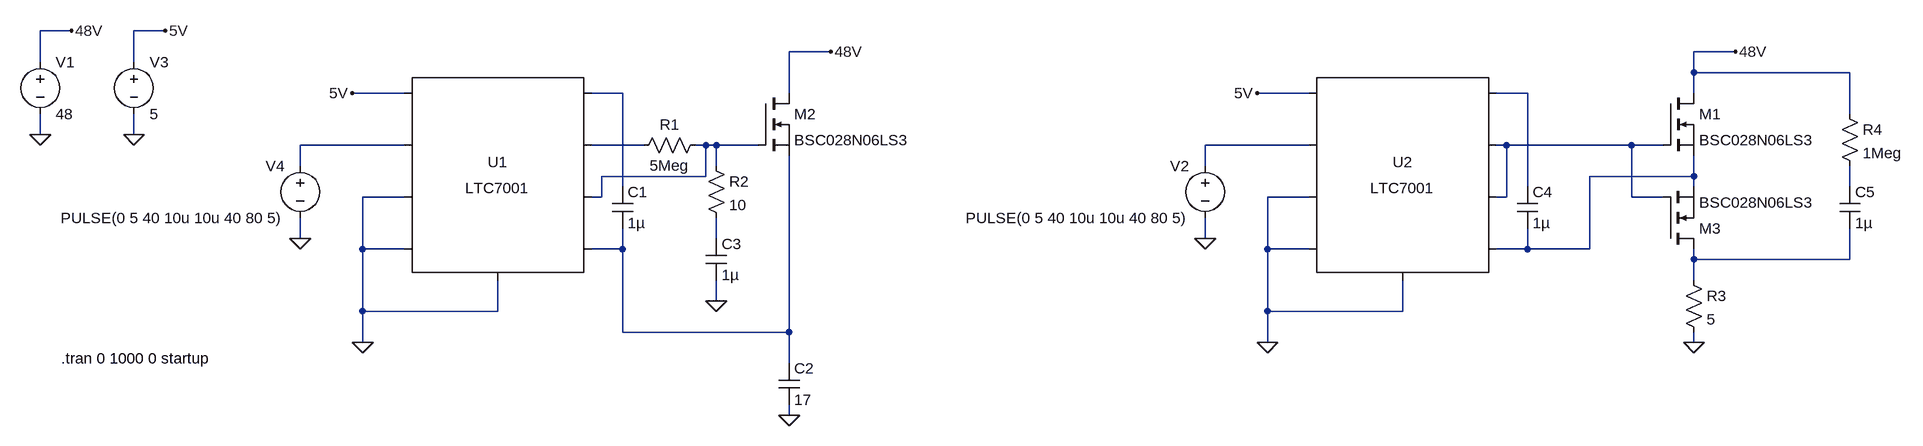
[diagram p0: schematic highside_pmos.asc]
highside_pmos.asc, the LTspice schematic file:
Version 4
SHEET 1 2584 1332
WIRE -240 544 -288 544
WIRE -96 544 -144 544
WIRE 928 576 864 576
WIRE 2320 576 2256 576
WIRE -288 592 -288 544
WIRE -144 592 -144 544
WIRE 2256 608 2256 576
WIRE 2496 608 2256 608
WIRE 272 640 192 640
WIRE 608 640 560 640
WIRE 864 640 864 576
WIRE 1664 640 1584 640
WIRE 2000 640 1952 640
WIRE 2256 640 2256 608
WIRE 2496 672 2496 608
WIRE -288 704 -288 672
WIRE -144 704 -144 672
WIRE 272 720 112 720
WIRE 640 720 560 720
WIRE 736 720 720 720
WIRE 752 720 736 720
WIRE 816 720 752 720
WIRE 1664 720 1504 720
WIRE 1968 720 1952 720
WIRE 2160 720 1968 720
WIRE 2208 720 2160 720
WIRE 112 752 112 720
WIRE 752 752 752 720
WIRE 1504 752 1504 720
WIRE 736 768 736 720
WIRE 736 768 576 768
WIRE 2256 768 2256 736
WIRE 2256 768 2096 768
WIRE 608 784 608 640
WIRE 2000 784 2000 640
WIRE 2256 784 2256 768
WIRE 2496 784 2496 752
WIRE 272 800 208 800
WIRE 576 800 576 768
WIRE 576 800 560 800
WIRE 1664 800 1600 800
WIRE 1968 800 1968 720
WIRE 1968 800 1952 800
WIRE 2160 800 2160 720
WIRE 2208 800 2160 800
WIRE 112 864 112 832
WIRE 752 864 752 832
WIRE 1504 864 1504 832
WIRE 208 880 208 800
WIRE 272 880 208 880
WIRE 608 880 608 848
WIRE 608 880 560 880
WIRE 1600 880 1600 800
WIRE 1664 880 1600 880
WIRE 2000 880 2000 848
WIRE 2000 880 1952 880
WIRE 2096 880 2096 768
WIRE 2096 880 2000 880
WIRE 2256 896 2256 880
WIRE 2496 896 2496 848
WIRE 2496 896 2256 896
WIRE 2256 928 2256 896
WIRE 752 960 752 928
WIRE 208 976 208 880
WIRE 416 976 416 928
WIRE 416 976 208 976
WIRE 1600 976 1600 880
WIRE 1808 976 1808 928
WIRE 1808 976 1600 976
WIRE 608 1008 608 880
WIRE 864 1008 864 736
WIRE 864 1008 608 1008
WIRE 208 1024 208 976
WIRE 1600 1024 1600 976
WIRE 2256 1024 2256 1008
WIRE 864 1056 864 1008
WIRE 864 1136 864 1120
FLAG -144 704 0
FLAG -96 544 5V
FLAG 192 640 5V
FLAG 208 1024 0
FLAG 112 864 0
FLAG 928 576 48V
FLAG 752 960 0
FLAG -288 704 0
FLAG -240 544 48V
FLAG 1584 640 5V
FLAG 1600 1024 0
FLAG 1504 864 0
FLAG 2320 576 48V
FLAG 2256 1024 0
FLAG 864 1136 0
SYMBOL PowerProducts\\LTC7001 416 768 R0
SYMATTR InstName U1
SYMBOL voltage -144 576 R0
WINDOW 123 0 0 Left 0
WINDOW 39 0 0 Left 0
SYMATTR InstName V3
SYMATTR Value 5
SYMBOL nmos 816 640 R0
SYMATTR InstName M2
SYMATTR Value BSC028N06LS3
SYMBOL cap 592 784 R0
SYMATTR InstName C1
SYMATTR Value 1µ
SYMBOL voltage 112 736 M0
WINDOW 123 0 0 Left 0
WINDOW 39 0 0 Left 0
SYMATTR InstName V4
SYMATTR Value PULSE(0 5 40 10u 10u 40 80 5)
SYMBOL res 736 704 R90
WINDOW 0 0 56 VBottom 2
WINDOW 3 32 56 VTop 2
SYMATTR InstName R1
SYMATTR Value 5Meg
SYMBOL res 736 736 R0
SYMATTR InstName R2
SYMATTR Value 10
SYMBOL cap 736 864 R0
SYMATTR InstName C3
SYMATTR Value 1µ
SYMBOL voltage -288 576 R0
WINDOW 123 0 0 Left 0
WINDOW 39 0 0 Left 0
SYMATTR InstName V1
SYMATTR Value 48
SYMBOL PowerProducts\\LTC7001 1808 768 R0
SYMATTR InstName U2
SYMBOL nmos 2208 640 R0
SYMATTR InstName M1
SYMATTR Value BSC028N06LS3
SYMBOL cap 1984 784 R0
SYMATTR InstName C4
SYMATTR Value 1µ
SYMBOL voltage 1504 736 M0
WINDOW 123 0 0 Left 0
WINDOW 39 0 0 Left 0
SYMATTR InstName V2
SYMATTR Value PULSE(0 5 40 10u 10u 40 80 5)
SYMBOL nmos 2208 880 M180
SYMATTR InstName M3
SYMATTR Value BSC028N06LS3
SYMBOL res 2240 912 R0
SYMATTR InstName R3
SYMATTR Value 5
SYMBOL res 2480 656 R0
SYMATTR InstName R4
SYMATTR Value 1Meg
SYMBOL cap 2480 784 R0
SYMATTR InstName C5
SYMATTR Value 1µ
SYMBOL cap 848 1056 R0
SYMATTR InstName C2
SYMATTR Value 17
TEXT -256 1048 Left 2 !.tran 0 1000 0 startup

The netlist it stands for:
* highside_pmos.asc
XU1 5V 0 0 N003 0 N005 N004 N011 N001 LTC7001
V3 5V 0 5
M2 48V N005 N011 N011 BSC028N06LS3
C1 N001 N011 1µ
V4 N003 0 PULSE(0 5 40 10u 10u 40 80 5)
R1 N005 N004 5Meg
R2 N005 N010 10
C3 N010 0 1µ
V1 48V 0 48
XU2 5V 0 0 N006 0 N007 N007 N008 N002 LTC7001
M1 48V N007 N008 N008 BSC028N06LS3
C4 N002 N008 1µ
V2 N006 0 PULSE(0 5 40 10u 10u 40 80 5)
M3 N012 N007 N008 N008 BSC028N06LS3
R3 N012 0 5
R4 48V N009 1Meg
C5 N009 N012 1µ
C2 N011 0 17
.model NMOS NMOS
.model PMOS PMOS
.lib standard.mos
.tran 0 1000 0 startup
.lib LTC7001.sub
.backanno
.end